# EAGLE design microsd (EAGLE 9.2.1)
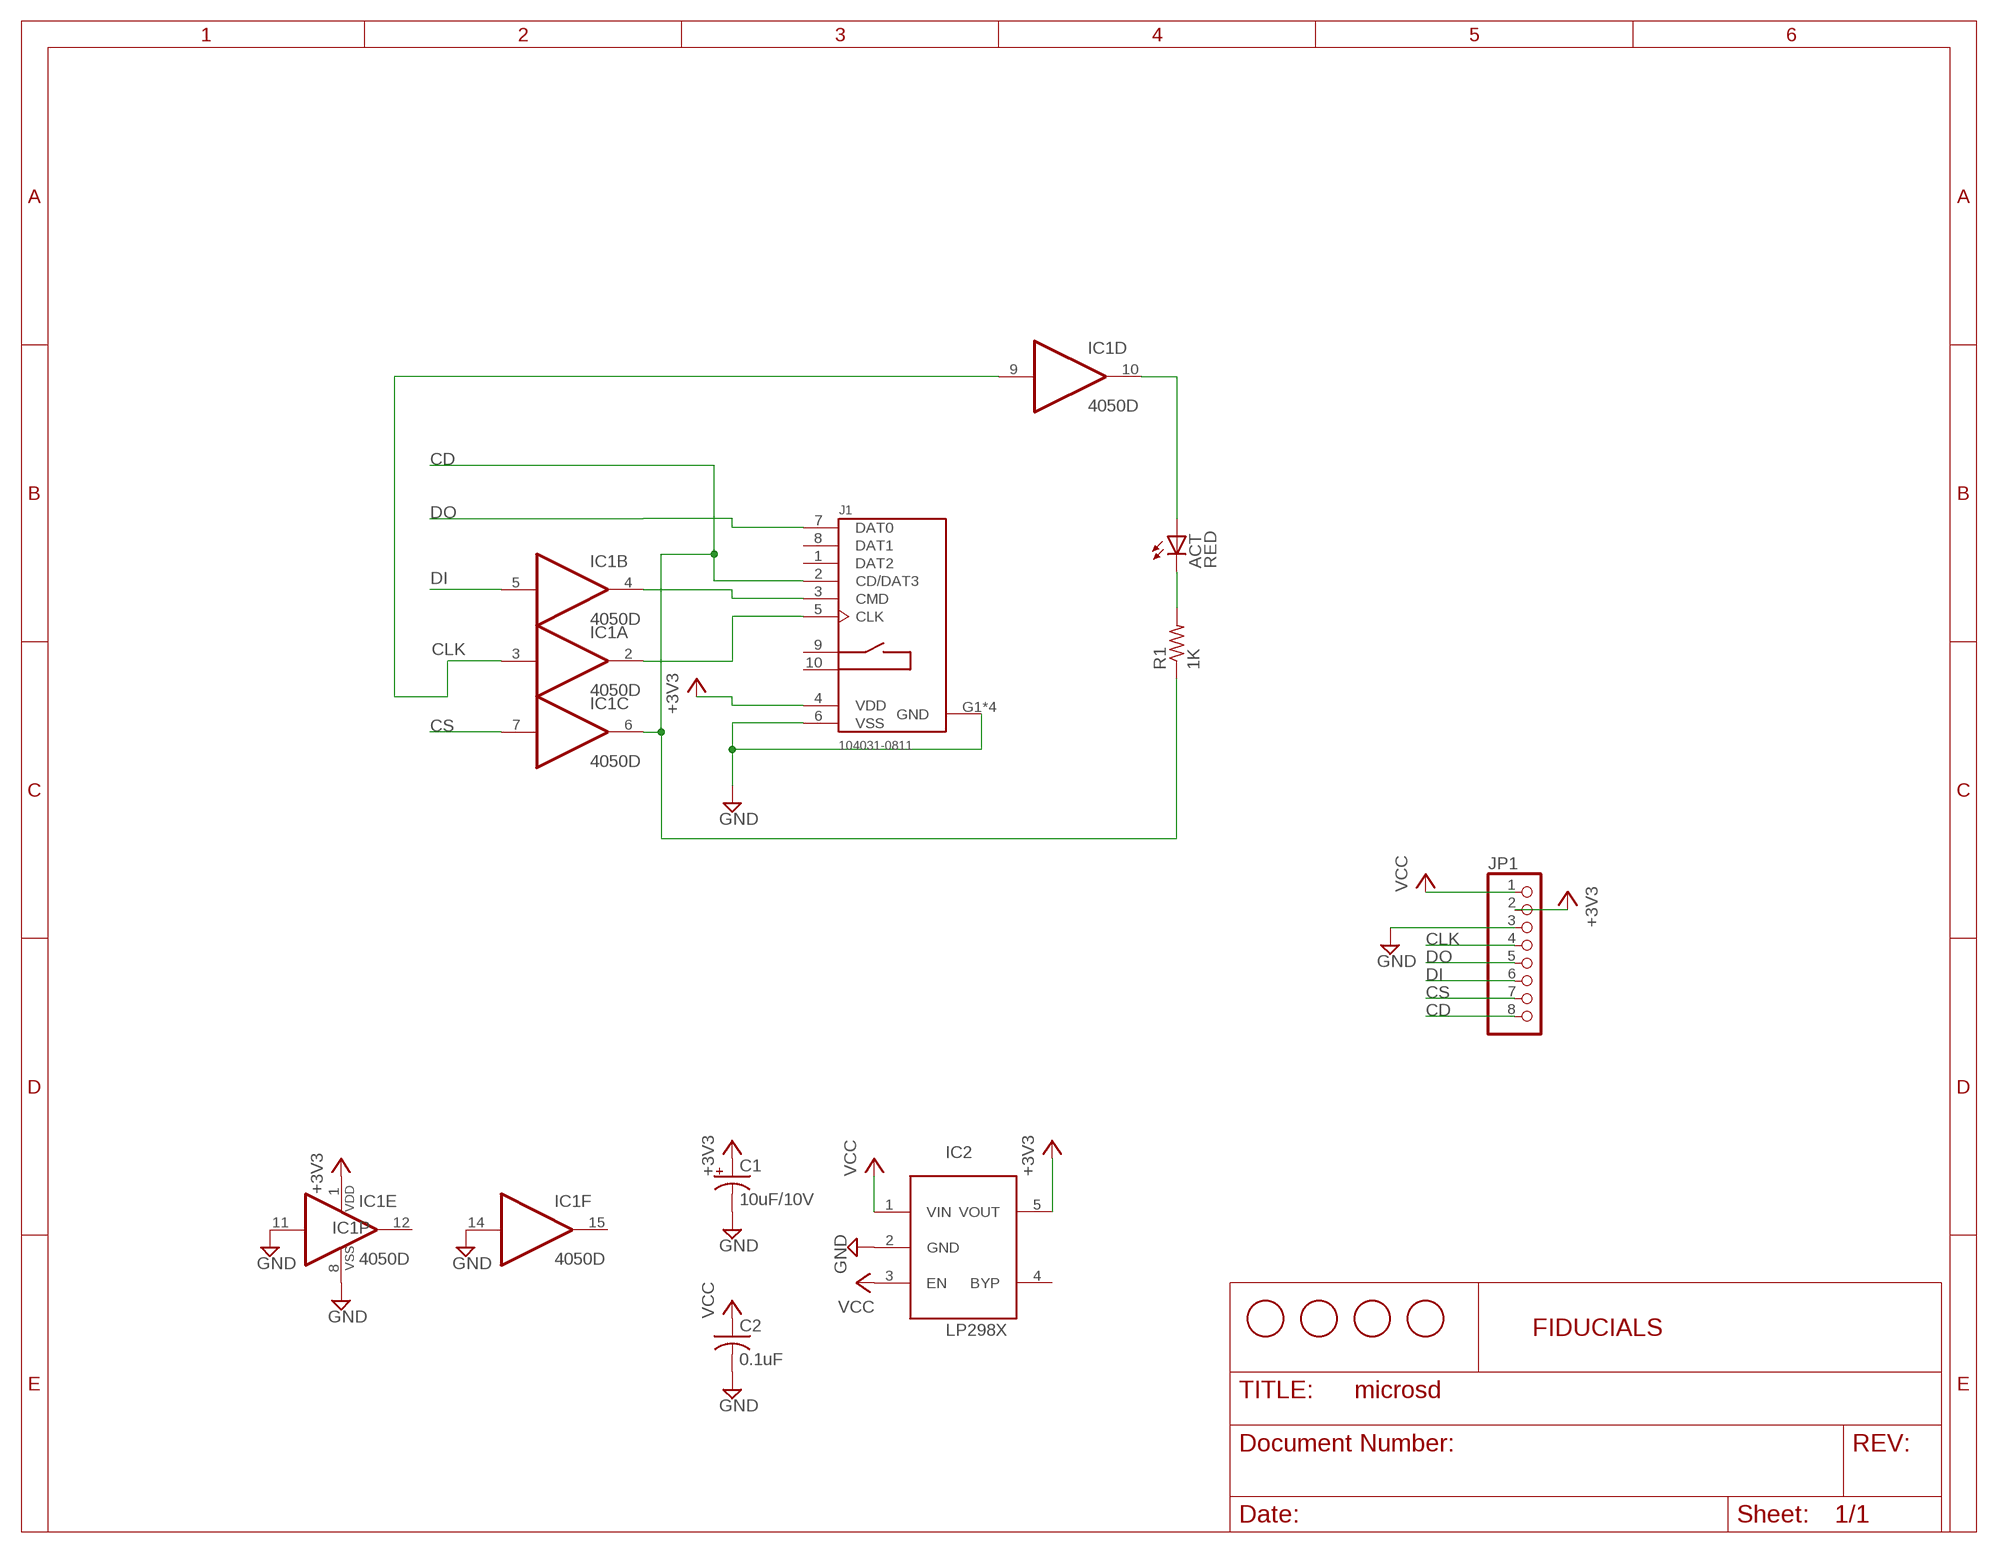
[diagram p0: schematic, sheet 1]

## Parts
ACT  RED  LEDCHIP-LED0805  [CHIP-LED0805]
C1  10uF/10V  CPOL-USA/3216-18R  [A/3216-18R]
C2  0.1uF  C-USC0805K  [C0805K]
IC1  4050D  [SO16]
IC2  LP298XS  [SOT23-5L]
J1  104031-0811  [MOLEX_104031-0811]
JP1  PINHD-1X8BIG  [1X08-BIG]
R1  1K  R-US_R0805  [R0805]
U$1  FIDUCIAL  [FIDUCIAL_1MM]
U$2  FIDUCIAL  [FIDUCIAL_1MM]
U$3  FIDUCIAL  [FIDUCIAL_1MM]
U$4  FIDUCIAL  [FIDUCIAL_1MM]

## Nets
+3V3: C1.+ IC1.1(P:VDD) IC2.5(VOUT) J1.4(VDD) JP1.2
CD: IC1.6(C:O) J1.2(CD/DAT3) JP1.8 R1.1
CLK: IC1.3(A:I) IC1.9(D:I) JP1.4
CS: IC1.7(C:I) JP1.7
DI: IC1.5(B:I) JP1.6
DO: J1.7(DAT0) JP1.5
GND: C1.- C2.2 IC1.8(P:VSS) IC1.11(E:I) IC1.14(F:I) IC2.2(GND) J1.6(VSS) J1.G1(GND) J1.G2(GND) J1.G3(GND) J1.G4(GND) JP1.3
N$1: ACT.A IC1.10(D:O)
N$2: IC1.2(A:O) J1.5(CLK)
N$4: ACT.C R1.2
N$5: IC1.4(B:O) J1.3(CMD)
VCC: C2.1 IC2.1(VIN) IC2.3(EN) JP1.1
Unconnected: IC1.12(E:O) IC1.15(F:O) IC2.4(BYP) J1.1(DAT2) J1.8(DAT1) J1.9(CARD_DET1) J1.10(CARD_DET2)

## Notes on the sheet
- FIDUCIALS

## Library data of the parts
ACT = adafruit:LED: LED OSRAM: - CHIPLED LG R971, LG N971, LY N971, LG Q971, LY Q971, LO R971, LY R971 LH N974, LH R974 LS Q976, LO Q976, LY Q976 LO Q996 - Hyper CHIPLED LW Q18S LB Q993, LB Q99A, LB R99A - SideLED LS A670, LO A670, LY A670, LG A670, LP A670 LB A673, LV A673, LT A673, LW A673 LH A674 LY A675 LS A676, LA A676, LO A676, LY A676, LW A676 LS A679, LY A679, LG A679 - Hyper Micro SIDELED® LS Y876, LA Y876, LO Y876, LY Y876 LT Y87S - SmartLED LW L88C, LW L88S LB L89C, LB L89S, LG L890 LS L89K, LO L89K, LY L89K LS L896, LA L896, LO L896, LY L896 - TOPLED LS T670, LO T670, LY T670, LG T670, LP T670 LSG T670, LSP T670, LSY T670, LOP T670, LYG T670 LG T671, LOG T671, LSG T671 LB T673, LV T673, LT T673, LW T673 LH T674 LS T676, LA T676, LO T676, LY T676, LB T676, LH T676, LSB T676, LW T676 LB T67C, LV T67C, LT T67C, LS T67K, LO T67K, LY T67K, LW E67C LS E67B, LA E67B, LO E67B, LY E67B, LB E67C, LV E67C, LT E67C LW T67C LS T679, LY T679, LG T679 LS T770, LO T770, LY T770, LG T770, LP T770 LB T773, LV T773, LT T773, LW T773 LH T774 LS E675, LA E675, LY E675, LS T675 LS T776, LA T776, LO T776, LY T776, LB T776 LHGB T686 LT T68C, LB T68C - Hyper Mini TOPLED® LB M676 - Mini TOPLED Santana® LG M470 LS M47K, LO M47K, LY M47K Source: http://www.osram.convergy.de/
C1 = adafruit:CPOL-US: POLARIZED CAPACITOR, American symbol
C2 = adafruit:C-US: CAPACITOR, American symbol
IC1 = 40xx:4050: Hex non-inverting BUFFER
IC2 = adafruit:LP298X
J1 = 104031-0811:104031-0811: 1.10mm Pitch microSD Memory Card Connector, SMT, Push-Pull Type, 1.42mm Height, with Detect Switch; AVAILABILITY: Unavailable; DESCRIPTION: 1.10mm Pitch microSD Memory Card Connector, SMT, Push-Pull Type, 1.42mm Height, with Detect Switch; MF: Molex; MP: 104031-0811; PACKAGE: None; PRICE: None
JP1 = adafruit:PINHD-1X8: PIN HEADER
R1 = adafruit:R-US_: RESISTOR, American symbol
U$1-U$4 = adafruit:FIDUCIAL: For use by pick and place machines to calibrate the vision/machine, 1mm By microbuilder.eu

## Board
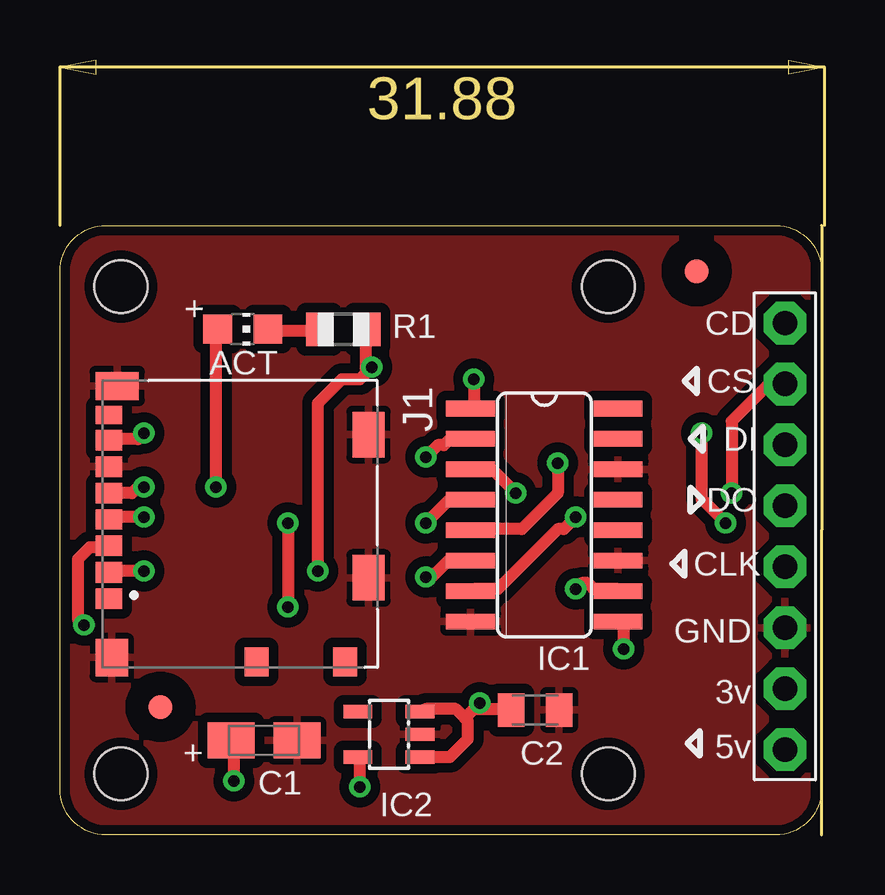
[diagram p1: board, top side]
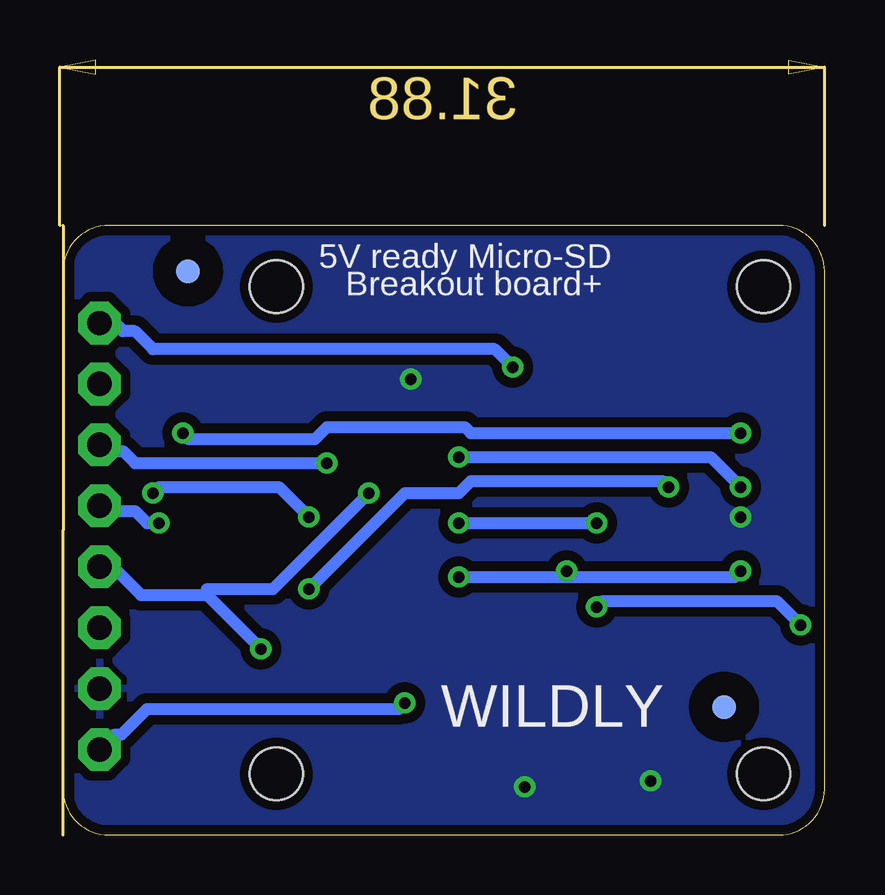
[diagram p2: board, bottom side, seen from below]

Size 31.75 x 25.4 mm. Coordinates in mm from the lower left corner, seen from the top.
Outline: 31.75,1.91 arc-90 29.84,0 1.91,0 arc-90 0,1.91 0,23.5 arc-90 1.91,25.4 29.84,25.4 arc-90 31.75,23.5 31.75,1.91
Copper layers (1*16): Top 0.035mm / dielectric 1.5mm / Bottom 0.035mm
Design rules "default *": minimum track width 20mil, minimum drill 19mil, track to track 12mil, track to pad 12mil, pad to pad 12mil, via to via 12mil, smd to smd 0mil, copper to edge 16mil, drill to drill 8mil, minimum pad ring 10mil, minimum via ring 8mil, stop-mask expansion 4mil, vias tented up to drill 20mil, thermal gap 10mil
Holes 2.2 mm at 2.54,22.86 2.54,2.54 22.86,22.86 22.86,2.54

### Footprints (pad centres in the part's own frame; a part is rotated, then mirrored left to right if it is on the bottom)
CHIP-LED0805 = smd 1.2 x 1.2: A 0,-1.05; C 0,1.05
A/3216-18R = smd 1.95 x 1.5: + 1.375,0; - -1.375,0
C0805K = smd 1.1 x 1.4: 1 -1,0; 2 1,0
SO16 = smd 0.66 x 2.032: 1 -4.445,-3.073; 2 -3.175,-3.073; 3 -1.905,-3.073; 4 -0.635,-3.073; 5 0.635,-3.073; 6 1.905,-3.073; 7 3.175,-3.073; 8 4.445,-3.073; 9 4.445,3.073; 10 3.175,3.073; 11 1.905,3.073; 12 0.635,3.073; 13 -0.635,3.073; 14 -1.905,3.073; 15 -3.175,3.073; 16 -4.445,3.073
SOT23-5L = smd 0.55 x 1.2: 1 -0.95,-1.3; 2 0,-1.3; 3 0.95,-1.3; 4 0.95,1.3; 5 -0.95,1.3
MOLEX_104031-0811 = smd 0.85 x 1.1: 1 3.105,-5.2; 3 0.905,-5.2; 4 -0.195,-5.2; 5 -1.295,-5.2; 6 -2.395,-5.2; 7 -3.495,-5.2 | smd 0.875 x 1.1: 2 2.005,-5.2 | smd 0.75 x 1.1: 8 -4.545,-5.2 | smd 1.2 x 1: 9 5.74,0.95; 10 5.74,4.65 | smd 1.55 x 1.35: G1 5.565,-5.075 | smd 1.17 x 1.8: G2 -5.755,-4.85 | smd 1.9 x 1.35: G3 -3.73,5.625; G4 2.24,5.625
1X08-BIG = drill 1.016 pad 1.778 octagon: 1 -8.89,0; 2 -6.35,0; 3 -3.81,0; 4 -1.27,0; 5 1.27,0; 6 3.81,0; 7 6.35,0; 8 8.89,0
R0805 = smd 1.1 x 1.4: 1 -1,0; 2 1,0
FIDUCIAL_1MM = smd 1 x 1: 1 0,0

### Placement (x,y rotation side)
ACT  7.62,21.08 270 top
C1  8.51,3.94 180 top
C2  19.81,5.21 0 top
IC1  20.19,13.34 270 top
IC2  13.72,4.19 90 top
J1  7.24,12.95 270 top
JP1  30.23,12.45 90 top
R1  11.81,21.08 180 top
U$1  4.19,5.33 0 top
U$2  26.54,23.5 0 top
U$3  4.19,5.33 0 bottom
U$4  26.54,23.5 0 bottom

### Tracks (layer width: path | path; a pad name or v marks a point on that pad's centre or on a via)
+3V3  (via drill 0.48)
  Top 0.508: v3.5,13.25 2.25,13.25 J1.4 | v12.5,2 12.5,3 IC2.5 | v7.25,2.25 7.25,3.75 C1.+ | v17.25,19 17.25,18 IC1.1
  pour Bottom (isolate 0.406): 0,25.4 0,0 30.1,0 arc90 31.88,1.78 31.88,25.4
CD  (via drill 0.48)
  Top 0.508: v3.5,11 2.25,11 J1.2 | v15.25,10.75 15.5,10.75 16.25,11.5 17,11.5 IC1.6 | 12.75,19.5 12.75,19.25 12.5,19 11.75,19 10.75,18 v10.75,11 | 12.75,19.5 12.75,21 R1.1 | v13,19.5 12.75,19.5
  Bottom 0.508: v3.5,11 3.75,10.75 10.75,10.75 | v15.25,10.75 10.75,10.75 | v10.75,11 10.75,10.75 | v13,19.5 13.75,20.25 28,20.25 28.75,21 29.25,21 29.68,21.43 JP1.8
CLK  (via drill 0.48)
  Top 0.508: v23.5,7.75 23.5,8.75 IC1.9 | v19,14.25 18,15.25 17.25,15.25 IC1.3
  Bottom 0.508: 25.75,10 v23.5,7.75 | 25.75,10 28.5,10 29.75,11.25 29.91,11.25 JP1.4 | v19,14.25 23,10.25 25.75,10.25 25.75,10
CS  (via drill 0.48)
  Top 0.508: v21.5,13.25 21,12.75 20.75,12.75 18.25,10.25 17.25,10.25 IC1.7 | v28,14.25 28,17.25 29.72,18.97 JP1.7
  Bottom 0.508: v21.5,13.25 22.75,14.5 27.75,14.5 v28,14.25
DI  (via drill 0.48)
  Top 0.508: v20.75,15.5 20.75,14.25 19.25,12.75 17.25,12.75 IC1.5
  Bottom 0.508: v20.75,15.5 28.75,15.5 29.25,16 29.5,16 29.91,16.41 JP1.6
DO  (via drill 0.48)
  Top 0.508: v3.5,16.75 3.25,16.5 2.25,16.5 J1.7 | v26.75,16.75 26.75,14 v27.75,13
  Bottom 0.508: v3.5,16.75 14.75,16.75 15,17 20.75,17 21.25,16.5 26.5,16.5 v26.75,16.75 | v27.75,13 28.25,13 28.75,13.5 29.5,13.5 29.75,13.75 30.14,13.75 JP1.5
GND
  pour Top (isolate 0.406): -0.13,25.4 -0.13,0 31.75,0 31.75,25.4
N$1  (via drill 0.48)
  Top 0.508: v6.5,14.5 6.5,21 ACT.A | v21.5,10.25 21.75,10.5 22,10.5 22.25,10.25 23.25,10.25 IC1.10
  Bottom 0.508: v6.5,14.5 6.75,14.75 14.75,14.75 15.25,14.25 17.5,14.25 v21.5,10.25
N$2  (via drill 0.48)
  Top 0.508: v3.5,14.5 3.25,14.5 3,14.25 2.25,14.25 J1.5 | v15.25,15.75 15.75,16.25 16,16.25 16.25,16.5 17,16.5 IC1.2
  Bottom 0.508: v3.5,14.5 4.75,15.75 v15.25,15.75
N$4
  Top 0.508: ACT.C 8.75,21 10.75,21 R1.2
N$5  (via drill 0.48)
  Top 0.508: v1,8.75 0.75,9 0.75,11.5 1.25,12 2,12 J1.3 | v9.5,13 v9.5,9.5 | v15.25,13 16.25,14 17,14 IC1.4
  Bottom 0.508: v1,8.75 2,9.75 9.25,9.75 v9.5,9.5 | v15.25,13 v9.5,13
VCC  (via drill 0.48)
  Top 0.508: 16.88,4.88 17,4.75 17,4 16.25,3.25 15.25,3.25 IC2.1 | 16.88,4.88 16.5,5.25 15.25,5.25 IC2.3 | 17.5,5.25 17.25,5.25 16.88,4.88 | 17.5,5.25 18.75,5.25 C2.1 | v17.5,5.5 17.5,5.25
  Bottom 0.508: v17.5,5.5 17.75,5.25 28.25,5.25 29.32,4.18 29.61,4.18 JP1.1

### Text on the board
bPlace: 5V ready Micro-SD | Breakout board+
tNames: CD | CS | DI | DO | CLK | GND | 3v | 5v
bNames: WILDLY